# Altium schematic sheet HDMI_TO_GMSL.SchDoc
size A4; SheetNumber: 10; SheetTotal: 12
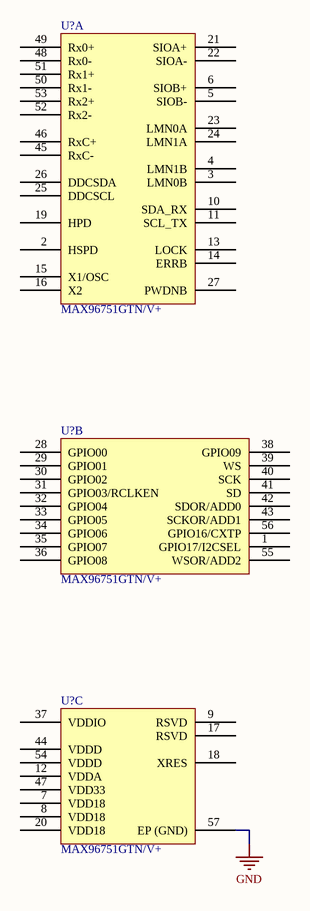
[diagram p0: HDMI_TO_GMSL.SchDoc]

## Parts
(Parts that share a designator on the sheet are numbered #1, #2 ... from top to bottom, then left to right.)
U?#1  MAX96751GTN/V+  [QFN50P800X800X80_HS-57N]  (part A of 3)
U?#2  MAX96751GTN/V+  [QFN50P800X800X80_HS-57N]  (part B of 3)
U?#3  MAX96751GTN/V+  [QFN50P800X800X80_HS-57N]  (part C of 3)

## Nets
GND: U?#3.57(EP_(GND))

Not connected (* = marked no-connect by the designer): U?#1 2(HSPD) 3(LMN0B) 4(LMN1B) 5(SIOB-) 6(SIOB+) 10(SDA_RX) 11(SCL_TX) 13(LOCK) 14(ERRB) 15(X1/OSC) 16(X2) 19(HPD) 21(SIOA+) 22(SIOA-) 23(LMN0A) 24(LMN1A) 25(DDCSCL) 26(DDCSDA) 27(PWDNB) 45(RxC-) 46(RxC+) 48(Rx0-) 49(Rx0+) 50(Rx1-) 51(Rx1+) 52(Rx2-) 53(Rx2+); U?#2 1(GPIO17/I2CSEL) 28(GPIO00) 29(GPIO01) 30(GPIO02) 31(GPIO03/RCLKEN) 32(GPIO04) 33(GPIO05) 34(GPIO06) 35(GPIO07) 36(GPIO08) 38(GPIO09) 39(WS) 40(SCK) 41(SD) 42(SDOR/ADD0) 43(SCKOR/ADD1) 55(WSOR/ADD2) 56(GPIO16/CXTP); U?#3 7(VDD18) 8(VDD18) 9(RSVD) 12(VDDA) 17(RSVD) 18(XRES) 20(VDD18) 37(VDDIO) 44(VDDD) 47(VDD33) 54(VDDD)

## Library data of the parts
U?#1-U?#3 = CMP-015-00018-1: GMSL2 Serializer with HDMI 2.0 Input